# Altium schematic sheet DIG_PDU.SchDoc
size 279 x 215 mm; SheetNumber: 4; SheetTotal: 4
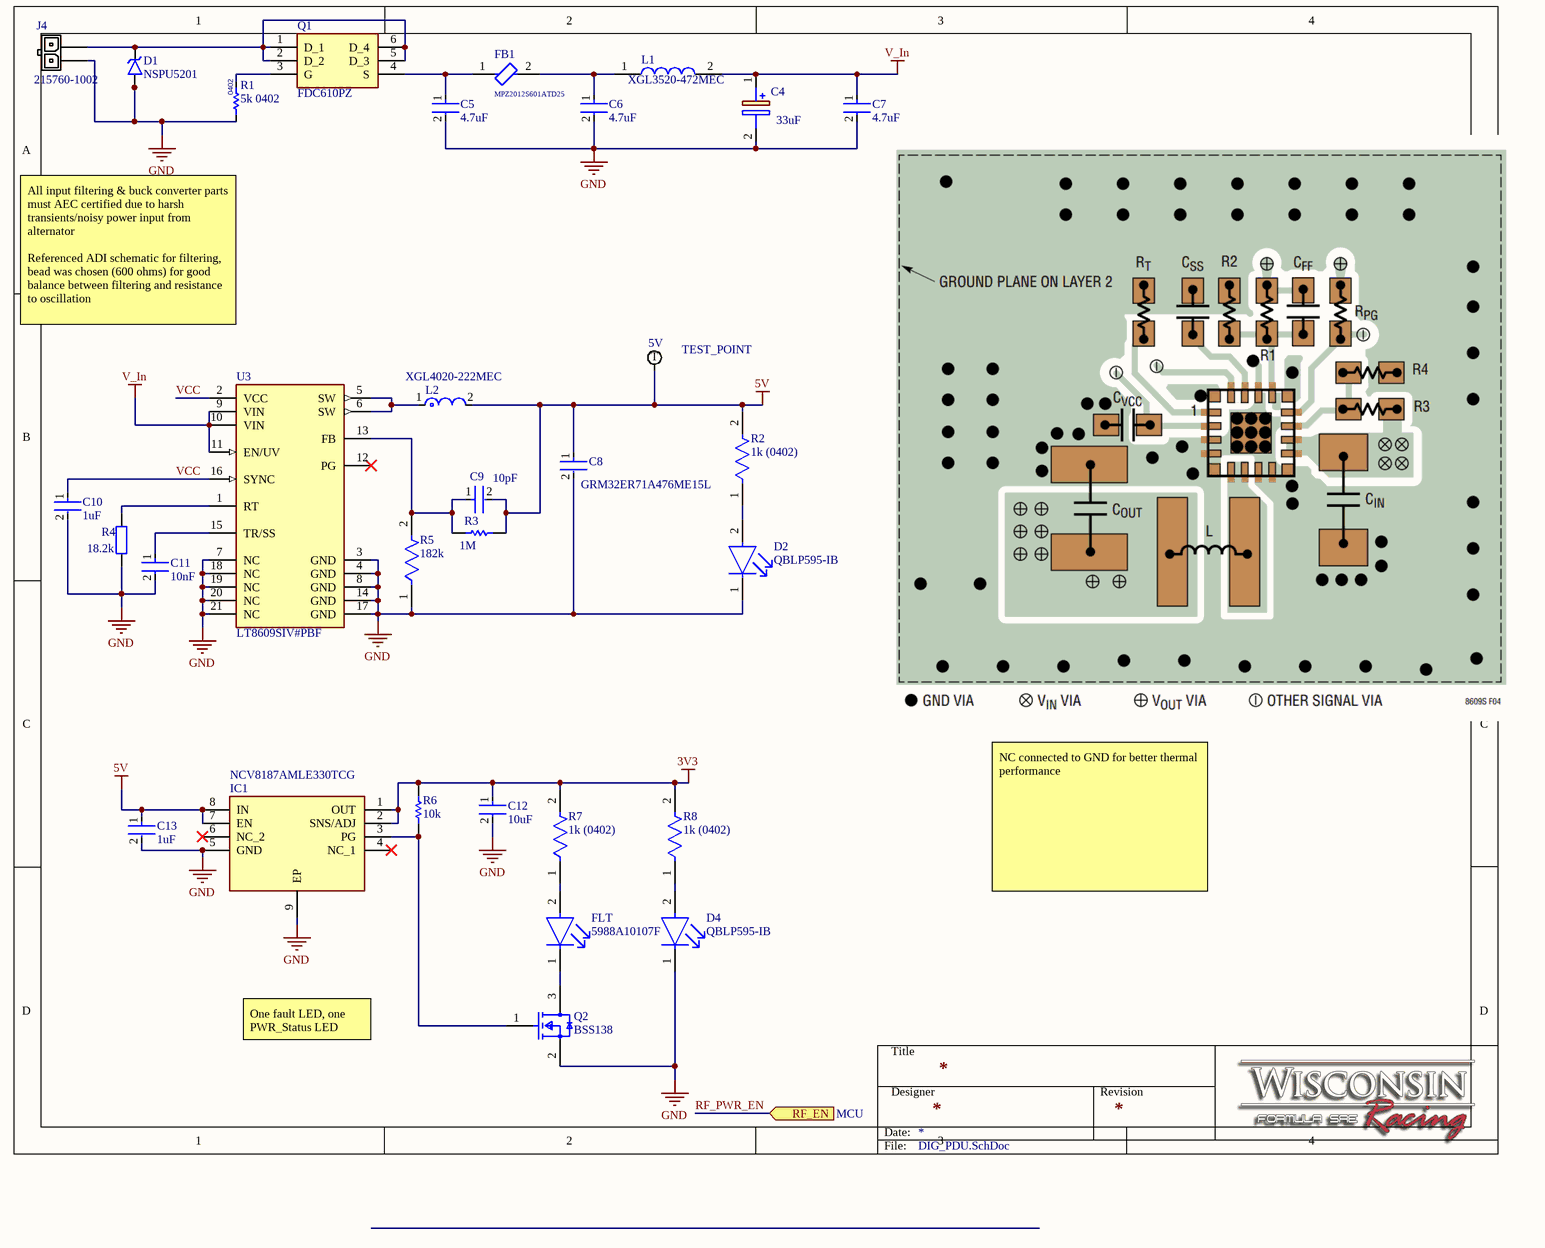
[diagram p0: DIG_PDU.SchDoc]

## Parts
5V  TEST_POINT  [TEST_POINT-Footprint-1]  (no BOM)
C4  HHXC500ARA330MF80G  [CAPAE660X800N]  (value not drawn)
C5  4.7uF  [FP-CGA4J-IPC_C]
C6  4.7uF  [FP-CGA4J-IPC_C]
C7  4.7uF  [FP-CGA4J-IPC_C]
C8  GRM32ER71A476ME15L  [FP-GRM32E-0_3-0_2-IPC_A]
C9  10pF  [FP-GCM155-0_05-IPC_C]
C10  1uF  [FP-GRT155-0_1-IPC_A]
C11  10nF  [FP-GCM155-0_05-IPC_C]
C12  10uF  [FP-GRM155-0_2-IPC_A]
C13  1uF  [FP-GRM155-0_1-IPC_C]
D1  NSPU5201  [NSPM5131MUTBG]
D2  QBLP595-IB  [FP-QBLP595-IB-MFG]
D4  QBLP595-IB  [FP-QBLP595-IB-MFG]
FB1  MPZ2012S601ATD25  [BEADC2012X105N]
FLT  5988A10107F  [FP-5988A10107F-MFG]
IC1  NCV8187AMLE330TCG  [SON65P300X300X100-9N-D]
J4  215760-1002  [215760-1002-Footprint-1]
L1  XGL3520-472MEC  [XGL3520472MEC]
L2  XGL4020-222MEC  [FP-XGL4020-MFG]
Q1  FDC610PZ  [SOT95P280X110-6N]
Q2  BSS138  [FP-318-08-IPC_B]
R1  5k 0402  [Res0402-Type-1]
R2  1k (0402)  [FP-RC0402-0_4-IPC_A]
R3  1M  [RESC1005X40X25NL05T10]
R4  18.2k  [WRIS-RSKS_0402]
R5  182k  [FP-AC0402-IPC_C]
R6  10k  [RESC1005X40X25ML05T05]
R7  1k (0402)  [FP-RC0402-0_4-IPC_A]
R8  1k (0402)  [FP-RC0402-0_4-IPC_A]
U3  LT8609SIV#PBF  [FP-LQFN-16-05-08-1516-MFG]

## Ports
RF_EN (in, see MCU)

## Nets
3V3: C12.1 IC1.1(OUT) IC1.2(SNS/ADJ) R6.2 R7.2 R8.2
5V: 5V.1 C8.1 C9.2 C13.1 IC1.7(EN) IC1.8(IN) L2.2 R2.2 R3.2
GND: C4.2(-) C5.2 C6.2 C7.2 C8.2 C10.2 C11.2 C12.2 C13.2 D1.5(GND_(A)_1) D1.6(GND_(A)_2) D1.7(GND_(A)_3) D1.8(GND_(A)_4) D2.1(C) D4.1(C) IC1.5(GND) IC1.9(EP) J4.2 Q2.2(S) R1.1 R4.1 R5.1 U3.3(GND) U3.4(GND) U3.7(NC) U3.8(GND) U3.14(GND) U3.17(GND) U3.18(NC) U3.19(NC) U3.20(NC) U3.21(NC)
V_In: C4.1(+) C7.1 L1.2 U3.9(VIN) U3.10(VIN) U3.11(EN/UV)
RF_PWR_EN: port RF_EN
VCC: C10.1 U3.2(VCC) U3.16(SYNC)
NetC5_1: C5.1 FB1.1 Q1.4(S)
NetC6_1: C6.1 FB1.2 L1.1
NetC9_1: C9.1 R3.1 R5.2 U3.13(FB)
NetC11_1: C11.1 U3.15(TR/SS)
NetD1_1: D1.1 D1.2 J4.1 Q1.1(D_1) Q1.2(D_2) Q1.5(D_3) Q1.6(D_4)
NetD2_2: D2.2(A) R2.1
NetD4_2: D4.2(A) R8.1
NetFLT_1: FLT.1(C) Q2.3(D)
NetFLT_2: FLT.2(A) R7.1
NetIC1_3: IC1.3(PG) Q2.1(G) R6.1
NetL2_1: L2.1 U3.5(SW) U3.6(SW)
NetQ1_3: Q1.3(G) R1.2
NetR4_2: R4.2 U3.1(RT)

Not connected (* = marked no-connect by the designer): IC1 4(NC_1)* 6(NC_2)*; U3 12(PG)*

## Notes on the sheet
- (near C4) 33uF
- All input filtering & buck converter parts must AEC certified due to harsh transients/noisy power input from alternator
  Referenced ADI schematic for filtering, bead was chosen (600 ohms) for good balance between filtering and resistance to oscillation
- NC connected to GND for better thermal performance
- One fault LED, one PWR_Status LED
- Title
- Designer
- Revision
- Date:
- File:
- (in symbol CMP-00005-4) T
- (in symbol CMP-Res-00031-1) 0402

## Library data of the parts
5V = CMP-00005-4: Pad for testing
C4 = HHXC500ARA330MF80G: Capacitor Polarised; Manufacturer_Name: Chemi-Con; Datasheet Link: https://www.digikey.com/en/products/detail/chemi-con/HHXC500ARA330MF80G/6928175; Height: 8mm; Manufacturer_Part_Number: HHXC500ARA330MF80G; Mouser Part Number: 661-HHXC500A330MF80G; Mouser Price/Stock: https://www.mouser.co.uk/ProductDetail/Chemi-Con/HHXC500ARA330MF80G?qs=u4fy%2FsgLU9MsXjhGLyQcVQ%3D%3D; Arrow Part Number: HHXC500ARA330MF80G; Arrow Price/Stock: null?utm_currency=USD&region=nac
C5-C7 = CMP-08246-000171-1: Cap Ceramic 4.7uF 50V X7R 10% Pad SMD 0805 +125°C Automotive T/R
C8 = CMP-2000-06363-3: Chip Multilayer Ceramic Capacitors for General Purpose, 1210, 47uF, X7R, 15%, 20%, 10V; Voltage Rating (DC): 10V; Lead Free: Lead Free; Capacitance: 47uF; Max Operating Temperature: 125°C; Height: 2.5mm; Min Operating Temperature: -55°C; Length: 3.2mm; Package Quantity: 1; Termination: SMD/SMT; Case Code (Imperial): 1210; Width: 0.098inch; Voltage Rating: 10V; Thickness: 0.106inch; Depth: 2.5mm; REACH SVHC: No SVHC; Packaging: Tape and Reel; Dielectric: X7R; Voltage: 10V; Radiation Hardening: No; Case Code (Metric): 3225; Tolerance: 20%; Case/Package: 1210; Mount: Surface Mount
C9 = CMP-06035-039712-1: Ceramic Capacitor for Automotive 10pF ±5% 50VDC C0G 0402 Paper T/R; Voltage Rating: 50V; Case/Package: 0402; Dielectric: C0G; Package Quantity: 10000; Ratings: AEC-Q200; Max Operating Temperature: 125°C; Width: 0.02inch; REACH SVHC: No SVHC; Mount: Surface Mount; Min Operating Temperature: -55°C; Lead Free: Lead Free; Packaging: Tape and Reel; Capacitance: 10pF; Case Code (Imperial): 0402; Tolerance: 5%; Height: 0.5mm; Thickness: 0.022inch; Length: 0.039inch; Case Code (Metric): 1005; Weight: 0.000212oz; Voltage Rating (DC): 50V; Termination: SMD/SMT
C10 = CMP-06035-047663-1: Multi-Layer Ceramic Capacitor 1uF 25V X6S ±10% 0402 Paper T/R / GRT155C81E105KE13D
C11 = CMP-2008-03723-3: Ceramic Capacitor for Automotive 10nF ±10% 50VDC X7R 0402 Paper T/R / GCM155R71H103KA55D; Voltage Rating (DC): 50V; Min Operating Temperature: -55°C; Radiation Hardening: No; Mount: Surface Mount; Thickness: 0.022inch; Package Quantity: 1; Case Code (Imperial): 0402; Lead Free: Lead Free; Case/Package: 0402; Depth: 0.5mm; Termination: SMD/SMT; Tolerance: 10%; Voltage: 50V; Packaging: Tape and Reel; Width: 0.02inch; REACH SVHC: No SVHC; Height: 0.5mm; Max Operating Temperature: 125°C; Case Code (Metric): 1005; Voltage Rating: 50V; Capacitance: 10nF; Ratings: AEC-Q200; Length: 1mm; Dielectric: X7R
C12 = CMP-06035-061139-1: Chip Multilayer Ceramic Capacitors for General Purpose, 0402, 10uF, X5R, 15%, 20%, 6.3V
C13 = CMP-06035-028020-1: Chip Multilayer Ceramic Capacitors for General Purpose, 0402, 1.0uF, X7R, 15%, 10%, 10V / GRM155Z71A105KE01D
D1 = CMP-004-000061-2: Unidirectional High Voltage ESD and Surge Protection; Provides ESD Protection to IEC6100042 Level 4: +/-30 kV Contact Discharge; Small Package: 1.8 mm x 2.0 mm; These Devices are PbFree; Manufacturer_Name: onsemi; Arrow Part Number: NSPU5201MUTBG; Design Item ID: NSPU5201MUTBG; Source: SamacSys.SchLib; Mouser Price/Stock: https://www.mouser.co.uk/ProductDetail/ON-Semiconductor/NSPU5201MUTBG?qs=byeeYqUIh0OtIrNH4%2Fsnzg%3D%3D; Mouser Part Number: 863-NSPU5201MUTBG; Height: 0mm; Datasheet Link: https://www.onsemi.com/pub/Collateral/NSPU5201-D.PDF; Manufacturer_Part_Number: NSPU5201MUTBG; Arrow Price/Stock: https://www.arrow.com/en/products/nspu5201mutbg/on-semiconductor
D2 D4 = CMP-113271-000002-1: LED BLUE CLEAR 0402 SMD; Lens Size: 0.5mm; Dominant Wavelength: 465nm; Forward Voltage: 3.1V; Lens Color: Colorless; Luminous Intensity: 85mcd; Test Current: 20mA; Viewing Angle: 140°; Lens Style: Flat; Width: 0.5mm; Case Code (Metric): 1005; Lens Transparency: Clear; Color: Blue; Packaging: Tape and Reel; Case Code (Imperial): 0402; Mount: Surface Mount; Length: 1mm; Case/Package: 0402; Height: 0.6mm
FB1 = CMP-002-000016-2: Ferrite Beads Multi-Layer Power 600Ohm 25% 100MHz 2A 100mOhm DCR 0805 Automotive T/R; Manufacturer_Name: TDK; Arrow Part Number: MPZ2012S601ATD25; Datasheet Link: https://product.tdk.com/system/files/dam/doc/product/emc/emc/beads/catalog/beads_automotive_power_mpz2012_en.pdf; Manufacturer_Part_Number: MPZ2012S601ATD25; Design Item ID: MPZ2012S601ATD25; Height: 1.05mm; Mouser Price/Stock: https://www.mouser.co.uk/ProductDetail/TDK/MPZ2012S601ATD25?qs=n0%2F4YYxsltT7vo9AjVUU7w%3D%3D; Mouser Part Number: 810-MPZ2012S601ATD25; Source: SamacSys.SchLib; Arrow Price/Stock: https://www.arrow.com/en/products/mpz2012s601atd25/tdk.html?utm_currency=USD&region=europe
FLT = CMP-00106-100993512-1: 5988A10107F LED Uni-Color Red 2-Pin Chip 0402(1006Metric) T/R; Forward Voltage: 1.6V; Forward Current: 5mA; Power Dissipation: 46mW; Reverse Voltage: 5V; Luminous Intensity: 65mcd; Viewing Angle: 140°; Wavelength: 635nm; Max Operating Temperature: 85°C; Case/Package: 0402; Color: Red; Height: 533.4µm; NexarPartId: 100993512; RoHS: Compliant; Schedule B: 8541402000, 8541402000; Min Operating Temperature: -40°C
IC1 = NCV8187AMLE330TCG: Integrated Circuit; Manufacturer_Name: onsemi; Datasheet Link: https://www.onsemi.com/pub/Collateral/NCV8187-D.PDF; Height: 1mm; Manufacturer_Part_Number: NCV8187AMLE330TCG; Mouser Part Number: 863-CV8187AMLE330TCG; Mouser Price/Stock: https://www.mouser.co.uk/ProductDetail/onsemi/NCV8187AMLE330TCG?qs=HBWAp0VN4RhK8HbhfCLXcQ%3D%3D; Arrow Part Number: NCV8187AMLE330TCG; Arrow Price/Stock: https://www.arrow.com/en/products/ncv8187amle330tcg/on-semiconductor?region=nac
J4 = CMP-007-000050-6: Micro-Fit+ Right-Angle Header, 3.00mm Pitch, Single Row, 2 Circuits, Matte Tin (Sn) Plating, UL 94V-0, Glow-Wire Capable, Black; Manufacturer 1: Molex; Number of Contacts: 2; Manufacturer Part Number 1: 215760-1002; Number of Rows: 1
L1 = XGL3520-472MEC: Inductor; Manufacturer_Name: COILCRAFT; Datasheet Link: https://www.coilcraft.com/getmedia/d18b8771-c466-42ab-98b9-5b7a3721ea57/xgl3520.pdf?srsltid=AfmBOoq9-uDh3EmdFKVY7cd9_AL22AmMmwAAQ9UBadXdflM2b3sgRKIR; Height: 2mm; Manufacturer_Part_Number: XGL3520-472MEC
L2 = CMP-11268-000045-2: Shielded Power Inductors
Q1 = FDC610PZ: MOSFET (P-Channel); Manufacturer_Name: onsemi; Datasheet Link: https://www.onsemi.com/pub/Collateral/FDC610PZ-D.PDF; Height: 1.1mm; Manufacturer_Part_Number: FDC610PZ; Mouser Part Number: 512-FDC610PZ; Mouser Price/Stock: https://www.mouser.co.uk/ProductDetail/onsemi-Fairchild/FDC610PZ?qs=6olcXJbp99R1vIAdhgXLVw%3D%3D; Arrow Part Number: FDC610PZ; Arrow Price/Stock: https://www.arrow.com/en/products/fdc610pz/on-semiconductor
Q2 = CMP-07173-000101-1: MOSFET N-CH 50V 220MA SOT-23; Turn-Off Delay Time: 20ns; Element Configuration: Single; Rds On Max: 3.5R; Gate to Source Voltage (Vgs): 20V; Threshold Voltage: 1.3V; Number of Elements: 1; Power Dissipation: 360mW; Rise Time: 9ns; Turn-On Delay Time: 2.5ns; Input Capacitance: 27pF; On-State Resistance: 6R; Lead Free: Lead Free; Length: 2.92mm; Width: 1.3mm; Drain to Source Breakdown Voltage: 50V; Min Operating Temperature: -55°C; REACH SVHC: No SVHC; Packaging: Tape and Reel; Radiation Hardening: No; Height: 0.93mm; Drain to Source Voltage (Vdss): 50V; Current Rating: 220mA; Voltage Rating (DC): 50V; Weight: 0.03g; Continuous Drain Current (ID): 220mA; Number of Pins: 3; Nominal Vgs: 1.3V; Max Power Dissipation: 360mW; Fall Time: 9ns; Drain to Source Resistance: 3.5R; Contact Plating: Tin; Case/Package: SOT-23; Package Quantity: 1; Dual Supply Voltage: 50V; Mount: Surface Mount; Termination: SMD/SMT; Max Operating Temperature: 150°C
R1 = CMP-Res-00031-1: Fixed Resistor, Metal Glaze/thick Film, 0.0625W, 5000ohm, 50V, 1% +/-Tol, 100ppm/Cel, Surface Mount, 0402; Power: 63mW; Resistance: 5k; Tolerance: 1%
R2 R7 R8 = CMP-2002-07472-3: RES 1K OHM 1% 1/16W 0402; Max Power Dissipation: 63mW; Resistance: 1kR; Voltage Rating (DC): 50V; Temperature Coefficient: 100ppm/°C; Power Rating: 62.5mW; Technology: THICK FILM; Size Code: 0402; Series: RC; Length: 1mm; Case/Package: 0402; Features: Moisture Resistant; Termination: SMD/SMT; Case Code (Metric): 1005; Reach SVHC Compliant: Yes; Number of Terminations: 2; Tolerance: 1%; Lead Free: Lead Free; Military Standard: Not; Resistor Type: Thick Film; Max Operating Temperature: 155°C; RoHS Compliant: Yes; Construction: Rectangular; Voltage Rating: 50V; Packaging: Tape and Reel; Height: 0.32mm; Number of Pins: 2; Resistance Tolerance: 1%; Case Code (Imperial): 0402; Depth: 0.5mm; Min Operating Temperature: -55°C; Width: 0.5mm
R3 = CMP-2002-07490-1: Manufacturer: Yageo / Phycomp; Part Number: RC0402FR-071ML
R4 = CMP-03913-145532814-2: Resistor, 18K2, 0.1W, Thick Film, 0402 Rohs Compliant: Yes; Manufacturer Lifecycle Status: ACTIVE; YEOL: 1 = Estimated lifetime > 10 years; Resistance: 18.2kΩ; Min Operating Temperature: -55°C; Height: 350µm; RoHS: Compliant; Lifecycle Status: Production; Width: 500µm; Length: 1mm; Max Operating Temperature: 155°C
R5 = CMP-03412-035751-2: RES 182kΩ ±1% 0.063W 0402; Max Power Dissipation: 63mW; Resistance: 182kR; Power Rating: 62.5mW; Temperature Coefficient: 100ppm/°C; Voltage Rating: 50V; Number of Terminations: 2; Tolerance: 1%; Case/Package: 0402; Min Operating Temperature: -55°C; Length: 0.039inch; Packaging: Tape and Reel; Case Code (Metric): 1005; Termination: SMD/SMT; Width: 0.5mm; RoHS Compliant: Yes; Resistor Type: Thick Film; Height: 0.015inch; Max Operating Temperature: 155°C; Series: AC; Case Code (Imperial): 0402; Weight: 2.3E-05oz; Features: Moisture Resistant
R6 = CMP-2002-00433-1: Part Number: ERJ-2GEJ103X; Manufacturer: Panasonic
U3 = CMP-09139-000009-1: IC REG BUCK ADJUSTABLE 2A 16LQFN; Manufacturer: Analog Devices; Standoff Height: 0.01mm; Nominal Supply Current: 1-1.7uA; Min Supply Voltage: 3V; Max Duty Cycle: 100%; Output Type: AdjustableProgrammable; Max Junction Temp: +125°C; Switching Frequency: 200-2200kHz; Max Supply Voltage: 42V; Number Of Outputs: 1; Digikey Description: IC REG BUCK ADJUSTABLE 2A 16LQFN; Octopart: https://octopart.com/lt8609siv%23pbf-analog+devices-88316701; Automotive: No; Package: LQFN-16-05-08-1516; Temperature Range High: +125°C; Category: IC; Temperature Range Low: -40°C; ComponentLink2Description: Datasheet; Output Current: 2A; Mouser Description: LT8609S - 42V, 2A/3A Peak Synchronous Step-Down Regulator with 2.5µA Quiescent Current; Temperature: -40°C to +125°C; ComponentLink2URL: https://www.analog.com/media/en/technical-documentation/data-sheets/LT8609S.pdf; RoHS: TRUE; Device Class L2: Power Management ICs; Device Class L3: Voltage Regulators - Switching; Height: 1.03mm; Device Class L1: Integrated Circuits (ICs); Switching Topology: Buck; Lead Free: Yes; Manufacturer Part Number: LT8609SIV#PBF